# Altium project CAN_shield.PrjPcb
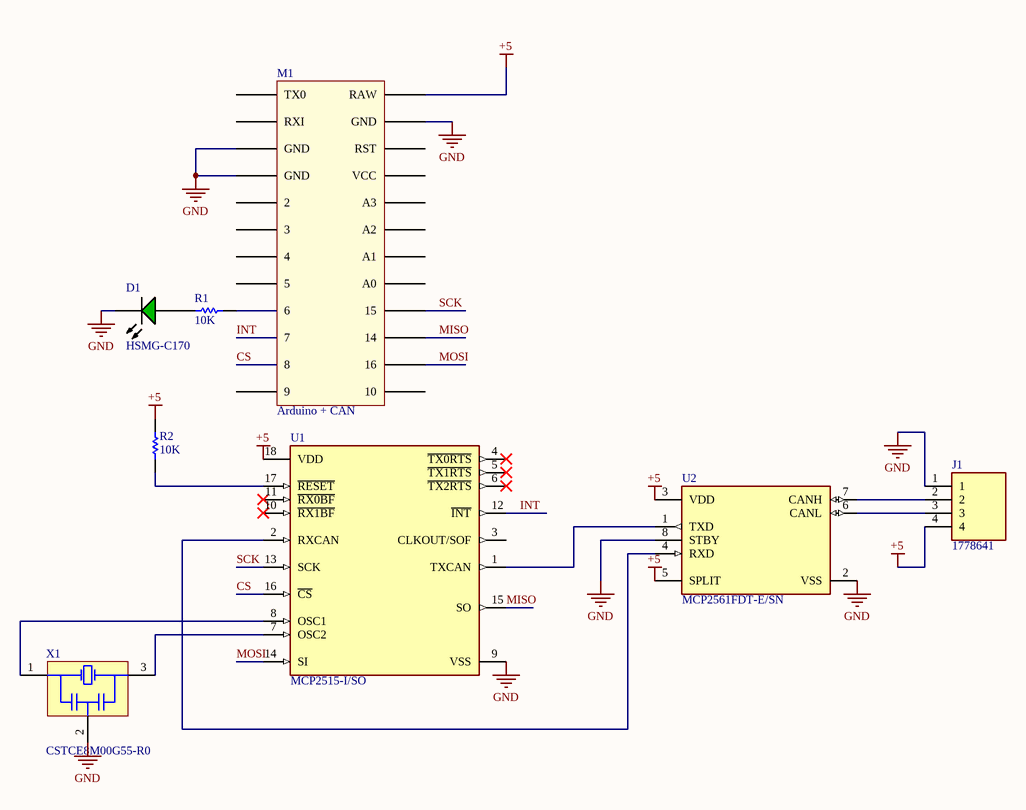
[diagram p0: Sheet1.SchDoc]
1 sheet, 8 parts. Net scope: global (net labels, ports and power ports of the same name join across sheets).
Board file: PCB1.PcbDoc

## Sheet Sheet1.SchDoc
size A4; SheetNumber: 1; SheetTotal: 1

### Parts
D1  HSMG-C170  [AVAG-HSMX-C170_V]
J1  1778641  [SHDRRA4W60P0X250_1X4_1170X750X510P]
M1  Arduino + CAN  [PCBComponent_1]
R1  10K  [RESC2013X50X30LL20T20]
R2  10K  [RESC2013X50X30LL20T20]
U1  MCP2515-I/SO  [FP-C04-051-MFG]
U2  MCP2561FDT-E/SN  [FP-C04-057-SN-MFG]
X1  CSTCE8M00G55-R0  [MURA-CSTCE_G_A-3_V]

### Nets
+5: J1.4 M1.24(RAW) R2.2 U1.18(VDD) U2.3(VDD) U2.5(SPLIT)
GND: D1.2(K) J1.1 M1.3(GND) M1.4(GND) M1.23(GND) U1.9(VSS) U2.2(VSS) U2.8(STBY) X1.2(GND)
CS: M1.11(8) U1.16(~{CS})
INT: M1.10(7) U1.12(~{INT})
MISO: M1.15(14) U1.15(SO)
MOSI: M1.14(16) U1.14(SI)
SCK: M1.16(15) U1.13(SCK)
NetD1_1: D1.1(A) R1.2
NetJ1_2: J1.2 U2.7(CANH)
NetJ1_3: J1.3 U2.6(CANL)
NetM1_9: M1.9(6) R1.1
NetR2_1: R2.1 U1.17(~{RESET})
NetU1_1: U1.1(TXCAN) U2.1(TXD)
NetU1_2: U1.2(RXCAN) U2.4(RXD)
NetU1_7: U1.7(OSC2) X1.3(X2)
NetU1_8: U1.8(OSC1) X1.1(X1)

Not connected (* = marked no-connect by the designer): M1 1(TX0) 2(RXI) 5(2) 6(3) 7(4) 8(5) 12(9) 13(10) 17(A0) 18(A1) 19(A2) 20(A3) 21(VCC) 22(RST); U1 3(CLKOUT/SOF) 4(~{TX0RTS})* 5(~{TX1RTS})* 6(~{TX2RTS})* 10(~{RX1BF})* 11(~{RX0BF})*

### Library data of the parts
D1 = CMP-2000-05062-1: Chip LED, Green, 2.2 V, -40 to 85 degC, 2-Pin SMD, Pb-Free, Tape and Reel; Manufacturer: Avago; No. of Pins: 2; Peak Wavelength: 570nm; SVHC: NoSVHC(16-Jun-2014); Dominant Wavelength: 572nm; Forward Current If: 20mA; Viewing Angle: 170deg; Lens Shape: Rectangular; PIV Max: 5V; External Width: 1.25mm; LED Type: Standard; External Depth: 0.8mm; Opto Mounting Orientation: Top; Luminous Intensity: 15mcd; Luminous Intensity Min: 4mcd; Forward Voltage VF Max: 2.6V; External Length / Height: 2mm; Bulb Size: 1.25mmx1.4mm; Light Area Height: 1mm; Voltage Vf Typ: 2.2V; Operating Temperature Max: 85degC; Datasheet Version: Oct-08; MSL: MSL2A-4weeks; Peak Forward Current: 20mA; Package Description: 2-Pin Surface Mount Device, Body 2 x 1.25 mm, Height 0.8 mm; Datasheet URL: https://datasheet.ciiva.com/29280/180495-da-01-en-chip-led-hsmg-c170-gelb-gruen-29280971.pdf; Storage Temperature Min: -40degC; LED Colour: Green; Wavelength Typ: 570nm; Mounting Type: SMD; Forward Current If Max: 20mA; Dominant Wavelength Typ: 572nm; LED Mounting: SMD; Operating Temperature Range: -30degCto+85degC; Operating Temperature Min: -30degC; Manufacturer URL: http://www.avagotech.com/; Packaging: CutTape; Luminous Intensity Typ: 15mcd; Package Reference: HSMX-C170; Storage Temperature Max: 85degC; Opto Case Style: SMD; Forward Voltage: 2.2V
J1 = 1778641: PCB header, nominal cross section: 0.5 mm?, color: black, nominal current: 6 A, rated voltage (III/2): 160 V, contact surface: Tin, type of contact: Male connector, Number of potentials: 4, Number of rows: 1, Number of positions per row: 4, number of connections: 4, product range: PTSM 0,5/..-HH-THR, pitch: 2.5 mm, mounting: THR soldering, pin layout: Linear pinning, solder pin [P]: 2.1 mm, Stecksystem: COMBICON COMPACT PTSM, Locking: without, type of packaging: 32 mm wide tape; Manufacturer_Name: Phoenix Contact; Geometry.Height: 5.1mm; Manufacturer_Part_Number: 1778641; Mouser Part Number: 651-1778641; Mouser Price/Stock: https://www.mouser.co.uk/ProductDetail/Phoenix-Contact/1778641?qs=i0qWf6NAoDs%252BwkQoFV1ycQ%3D%3D; Arrow Part Number: 1778641; Arrow Price/Stock: https://www.arrow.com/en/products/1778641/phoenix-contact?region=nac; Datasheet Link: http://www.phoenixcontact.com/de/produkte/1778641/pdf
M1 = Arduino: Arduino Pro Micro + CAN Shield
R1 R2 = CMP-2001-04896-1: Manufacturer: Vishay Dale; Part Number: CRCW08050000Z0EA
U1 = CMP-0186-00133-3: IC CAN CONTROLLER W/SPI 18SOIC; Manufacturer: Microchip; Min Supply Voltage: 2.7V; Max Supply Voltage: 5.5V; Standoff Height: 0.1mm; Nominal Supply Current: 10mA; Interface: SPI,CAN; Lead Free: Yes; Digikey Description: IC CAN CONTROLLER W/SPI 18SOIC; Category: IC; RoHS: TRUE; Manufacturer Part Number: MCP2515-I/SO; ComponentLink2URL: http://ww1.microchip.com/downloads/en/DeviceDoc/MCP2515-Stand-Alone-CAN-Controller-with-SPI-20001801J.pdf; Mouser Description: CAN Interface IC W/ SPI Interface; Device Class L2: Interface ICs; Package: C04-051; Automotive: No; Function: Controller; Octopart: https://octopart.com/mcp2515-i%2Fso-microchip-430187; Temperature: -40°C to +85°C; Ipc Land Pattern Name: SOIC127P1030X265-18; Ambient Temperature Range Low: -65°C; Height: 2.65mm; Device Class L1: Integrated Circuits (ICs); Ambient Temperature Range High: +125°C; Footprint Url: http://ww1.microchip.com/downloads/en/DeviceDoc/18L_SOIC_Wide_7.50_SO_C04-0051D.pdf; Temperature Range Low: -40°C; Device Class L3: Controllers; Temperature Range High: +85°C; ComponentLink2Description: Datasheet
U2 = CMP-06279-000064-1: IC TRANSCEIVER 1/1 8SOIC; Data Rate: 8Mbps; Operating Supply Current: 70mA; Max Supply Voltage: 5.5V; Number of Transceivers: 1; Receiver Hysteresis: 200mV; Min Supply Voltage: 4.5V; Case/Package: SOIC; Mount: Surface Mount; Weight: 0.019048oz; Min Operating Temperature: -40°C; Package Quantity: 3300; Series: -; Packaging: Tape and Reel; Max Operating Temperature: 125°C; RoHS Compliant: Yes; Number of Pins: 8
X1 = CMP-2100-03620-1: Ceramic Resonator, 8 MHz, +/- 0.5%, -20 to 80 degC, 3-Pin SMD, RoHS, Tape and Reel; Manufacturer: Murata; Capacitance: 33pF; Frequency Stability: 0.2%; Self Resonant Frequency: 8MHz; Datasheet Version: 42339.0; RoHSCompliant: True; Datasheet URL: http://www.murata.com/~/media/webrenewal/support/library/catalog/products/timingdevice/ceralock/p16e.ashx; Case/Package: Ceramic; Load Capacitance: 33pF; Tolerance: 0.5%; Mount: SurfaceMount; Height: 0.031inch; Number of Pins: 3; Package Description: 3-Pin Surface Mount Device, Body 3.2 x 1.3 mm, Pitch 1.2 mm; Package Quantity: 1; Lead Free: LeadFree; Contact Plating: Gold; REACH SVHC: NoSVHC; Length: 0.126inch; Width: 0.051inch; Manufacturer URL: http://www.murata.com/; Packaging: TapeandReel; Termination: SMD/SMT; Frequency Tolerance: 0.5%; Max Operating Temperature: 80degC; Composition: Ceramic; Package Reference: CSTCE_G_A-3; Min Operating Temperature: -20degC; Frequency: 8MHz